# EAGLE design PCBv3.2.1.Arduino (EAGLE 8.5.2)
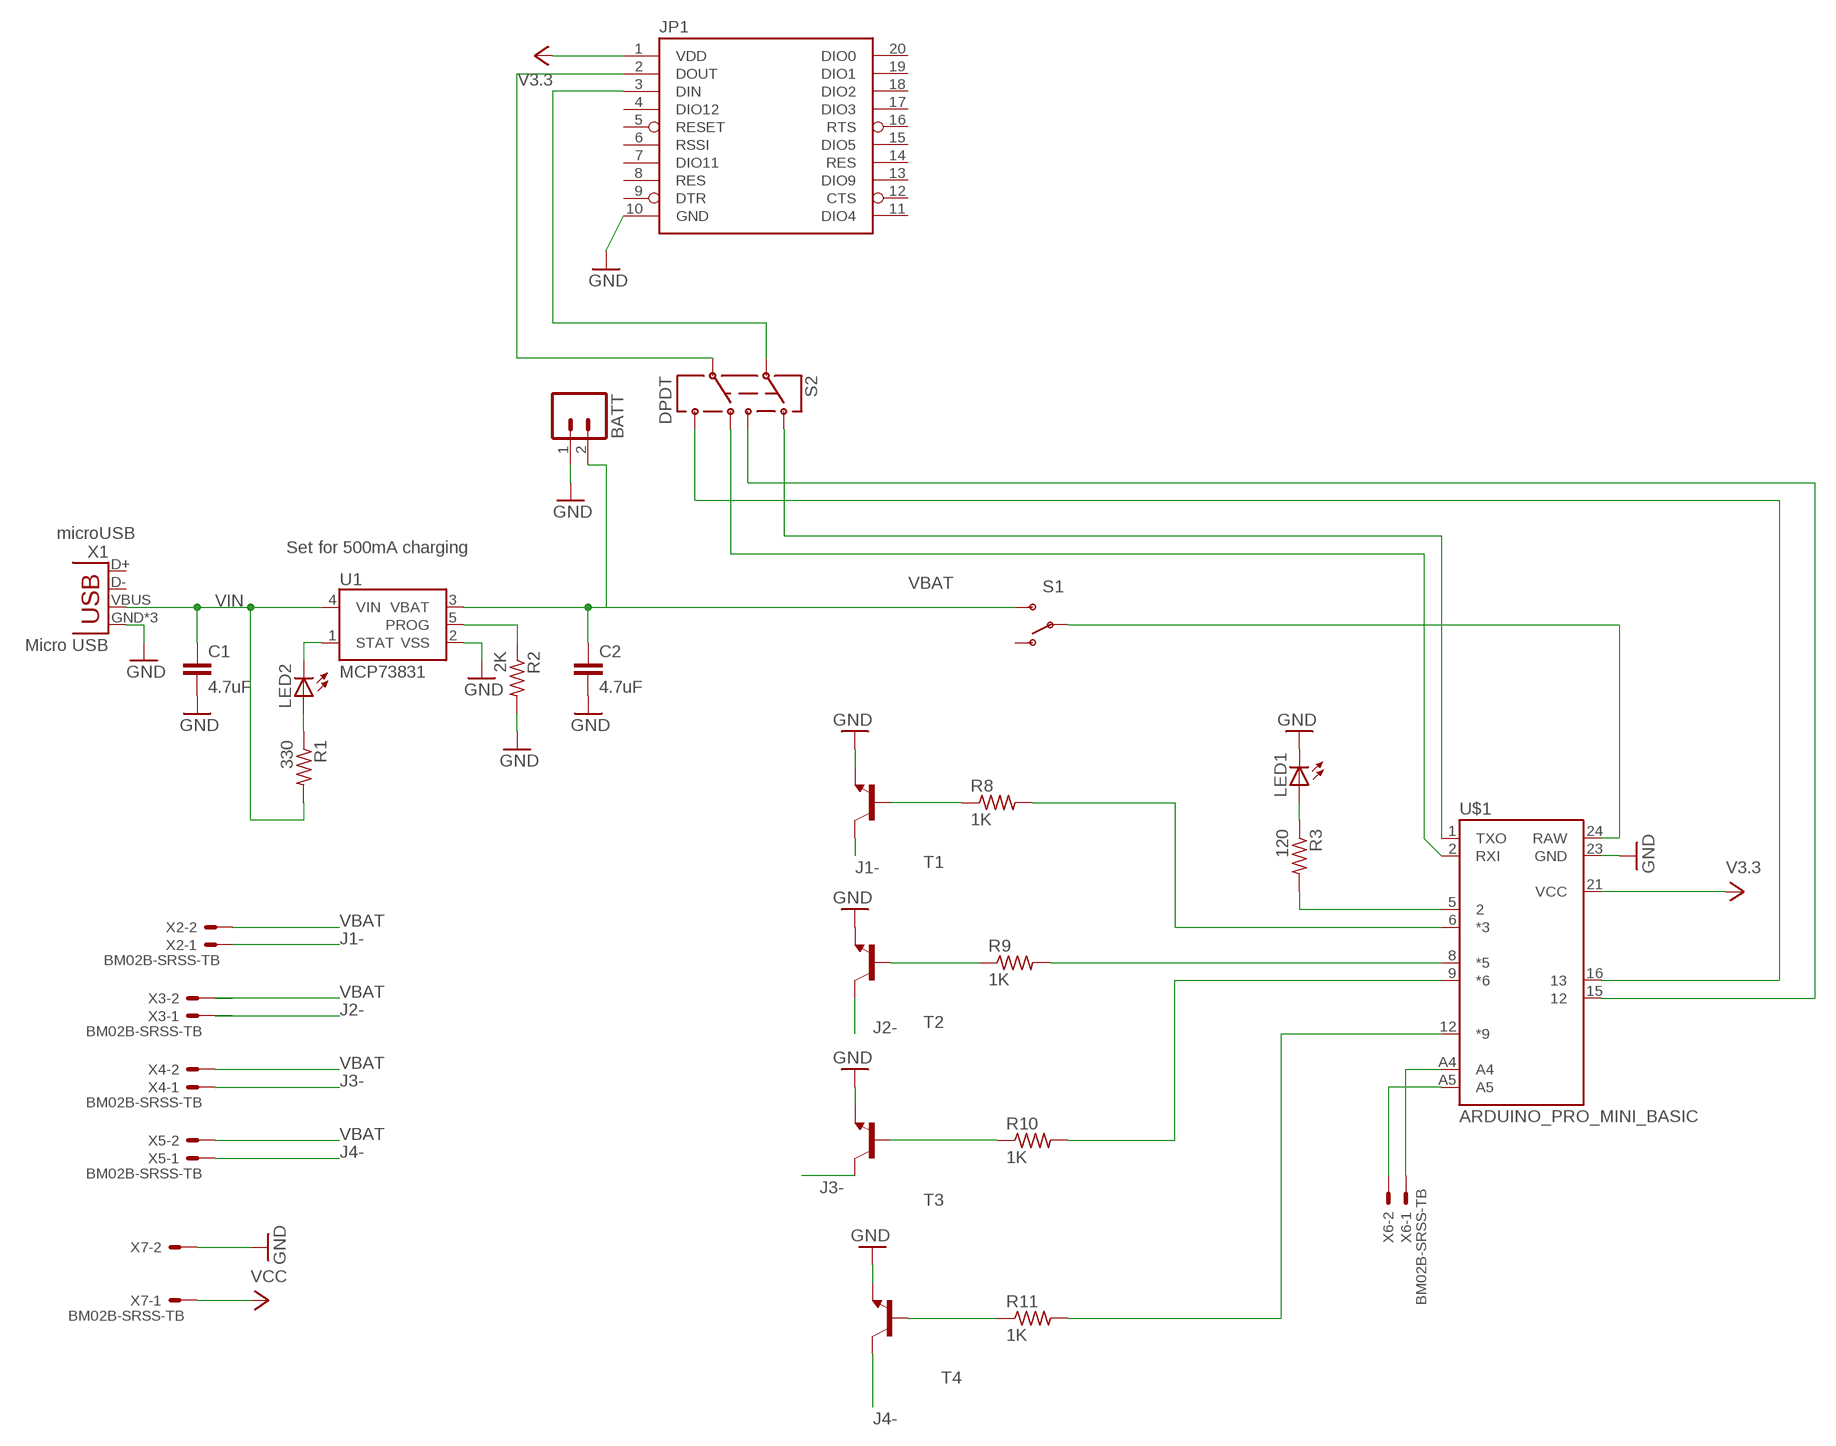
[diagram p0: schematic, sheet 1]

## Parts
BATT  M02JST-PTH-VERT  [JST-2-PTH-VERT]
C1  4.7uF  C-EUC0805  [C0805]
C2  4.7uF  C-EUC0805  [C0805]
JP1  XBEE-1LONGPAD  [XBEE-LONGPAD]
LED1  LED3MM  [LED3MM]
LED2  LEDCHIP-LED0805  [CHIP-LED0805]
R1  330  R-US_R0805  [R0805]
R2  2K  R-US_R0805  [R0805]
R3  120  R-US_R0805  [R0805]
R8  1K  R-US_R0805  [R0805]
R9  1K  R-US_R0805  [R0805]
R10  1K  R-US_R0805  [R0805]
R11  1K  R-US_R0805  [R0805]
S1  SWITCH-SPDTPTH  [SWITCH-SPDT]
S2  DPDT  AYZ0202  [AYZ0202]
T1  BC817-16-NPN-SOT23-BEC  [SOT23-BEC]
T2  BC817-16-NPN-SOT23-BEC  [SOT23-BEC]
T3  BC817-16-NPN-SOT23-BEC  [SOT23-BEC]
T4  BC817-16-NPN-SOT23-BEC  [SOT23-BEC]
U1  MCP73831  [SOT23-5]
U$1  ARDUINO_PRO_MINI_BASIC  [ARDUINO_PRO_MINI_BASIC]
X1  Micro USB  USB-MICROB  [USB-MICROB]
X2  BM02B-SRSS-TB  [BM02B-SRSS-TB]
X3  BM02B-SRSS-TB  [BM02B-SRSS-TB]
X4  BM02B-SRSS-TB  [BM02B-SRSS-TB]
X5  BM02B-SRSS-TB  [BM02B-SRSS-TB]
X6  BM02B-SRSS-TB  [BM02B-SRSS-TB]
X7  BM02B-SRSS-TB  [BM02B-SRSS-TB]

## Nets
GND: BATT.1 C1.2 C2.2 JP1.10(GND) LED1.K(C) R2.2 T1.E T2.E T3.E T4.E U1.2(VSS) U$1.23(GND) X1.GND X1.MT1(GND) X1.MT2(GND) X7.2
J1-: T1.C X2.1
J2-: T2.C X3.1
J3-: T3.C X4.1
J4-: T4.C X5.1
N$1: R3.2 U$1.5
N$2: U$1.A4 X6.1
N$3: U$1.A5 X6.2
N$5: R10.2 U$1.9(*6)
N$6: S2.1 U$1.15
N$7: S1.2(P) U$1.24(RAW)
N$8: LED1.A R3.1
N$9: R9.2 U$1.8(*5)
N$10: R8.1 T1.B
N$11: R8.2 U$1.6(*3)
N$12: LED2.A R1.1
N$13: S2.4 U$1.16
N$14: R9.1 T2.B
N$16: R11.1 T4.B
N$17: S2.6 U$1.2(RXI)
N$18: S2.3 U$1.1(TXO)
N$21: R11.2 U$1.12(*9)
N$22: R10.1 T3.B
N$23: JP1.2(DOUT) S2.5
N$25: JP1.3(DIN) S2.2
PROG: R2.1 U1.5(PROG)
STAT: LED2.C U1.1(STAT)
VBAT: BATT.2 C2.1 S1.3(S) U1.3(VBAT) X2.2 X3.2 X4.2 X5.2
VCC: JP1.1(VDD) U$1.21(VCC) X7.1 ; supply symbol labelled V3.3
VIN: C1.1 R1.2 U1.4(VIN) X1.VBUS
Unconnected: JP1.4(DIO12) JP1.5(RESET) JP1.6(RSSI) JP1.7(DIO11) JP1.8(RES) JP1.9(DTR) JP1.11(DIO4) JP1.12(CTS) JP1.13(DIO9) JP1.14(RES) JP1.15(DIO5) JP1.16(RTS) JP1.17(DIO3) JP1.18(DIO2) JP1.19(DIO1) JP1.20(DIO0) S1.1(O) X1.D+ X1.D-

## Notes on the sheet
- microUSB
- Set for 500mA charging

## Library data of the parts
BATT = SparkFun-Connectors:M02: Standard 2-pin 0.1" header. Use with - straight break away headers ( PRT-00116) - right angle break away headers (PRT-00553) - swiss pins (PRT-00743) - machine pins (PRT-00117) - female headers (PRT-00115) Molex polarized connector foot print use with: PRT-08233 with associated crimp pins and housings. 2.54_SCREWTERM for use with PRT-10571. 3.5mm Screw Terminal footprints for PRT-08084 5mm Screw Terminal footprints for use with PRT-08432; MF: JST (JAPAN SOLDERLESS TERMINALS); MPN: S2B-PH-K-S (LF)(SN); OC_FARNELL: 9491902
C1 C2 = rcl:C-EU: CAPACITOR, European symbol; MF: TDK; MPN: C1005X5R0J475K050BC; OC_FARNELL: 2346876
JP1 = SparkFun-RF:XBEE-1: Xbee module footprints; OC_FARNELL: unknown
LED1 = Personale:LED: LED OSRAM: - CHIPLED LG R971, LG N971, LY N971, LG Q971, LY Q971, LO R971, LY R971 LH N974, LH R974 LS Q976, LO Q976, LY Q976 LO Q996 - Hyper CHIPLED LW Q18S LB Q993, LB Q99A, LB R99A - SideLED LS A670, LO A670, LY A670, LG A670, LP A670 LB A673, LV A673, LT A673, LW A673 LH A674 LY A675 LS A676, LA A676, LO A676, LY A676, LW A676 LS A679, LY A679, LG A679 - Hyper Micro SIDELED® LS Y876, LA Y876, LO Y876, LY Y876 LT Y87S - SmartLED LW L88C, LW L88S LB L89C, LB L89S, LG L890 LS L89K, LO L89K, LY L89K LS L896, LA L896, LO L896, LY L896 - TOPLED LS T670, LO T670, LY T670, LG T670, LP T670 LSG T670, LSP T670, LSY T670, LOP T670, LYG T670 LG T671, LOG T671, LSG T671 LB T673, LV T673, LT T673, LW T673 LH T674 LS T676, LA T676, LO T676, LY T676, LB T676, LH T676, LSB T676, LW T676 LB T67C, LV T67C, LT T67C, LS T67K, LO T67K, LY T67K, LW E67C LS E67B, LA E67B, LO E67B, LY E67B, LB E67C, LV E67C, LT E67C LW T67C LS T679, LY T679, LG T679 LS T770, LO T770, LY T770, LG T770, LP T770 LB T773, LV T773, LT T773, LW T773 LH T774 LS E675, LA E675, LY E675, LS T675 LS T776, LA T776, LO T776, LY T776, LB T776 LHGB T686 LT T68C, LB T68C - Hyper Mini TOPLED® LB M676 - Mini TOPLED Santana® LG M470 LS M47K, LO M47K, LY M47K Source: http://www.osram.convergy.de LUXEON: - LUMILED® LXK2-PW12-R00, LXK2-PW12-S00, LXK2-PW14-U00, LXK2-PW14-V00 LXK2-PM12-R00, LXK2-PM12-S00, LXK2-PM14-U00 LXK2-PE12-Q00, LXK2-PE12-R00, LXK2-PE12-S00, LXK2-PE14-T00, LXK2-PE14-U00 LXK2-PB12-K00, LXK2-PB12-L00, LXK2-PB12-M00, LXK2-PB14-N00, LXK2-PB14-P00, LXK2-PB14-Q00 LXK2-PR12-L00, LXK2-PR12-M00, LXK2-PR14-Q00, LXK2-PR14-R00 LXK2-PD12-Q00, LXK2-PD12-R00, LXK2-PD12-S00 LXK2-PH12-R00, LXK2-PH12-S00 LXK2-PL12-P00, LXK2-PL12-Q00, LXK2-PL12-R00 Source: www.luxeon.com KINGBRIGHT: KA-3528ASYC Source: www.kingbright.com; MF: MULTICOMP; MPN: MCL034GT; OC_FARNELL: 1581123
LED2 = led:LED: LED OSRAM: - CHIPLED LG R971, LG N971, LY N971, LG Q971, LY Q971, LO R971, LY R971 LH N974, LH R974 LS Q976, LO Q976, LY Q976 LO Q996 - Hyper CHIPLED LW Q18S LB Q993, LB Q99A, LB R99A - SideLED LS A670, LO A670, LY A670, LG A670, LP A670 LB A673, LV A673, LT A673, LW A673 LH A674 LY A675 LS A676, LA A676, LO A676, LY A676, LW A676 LS A679, LY A679, LG A679 - Hyper Micro SIDELED® LS Y876, LA Y876, LO Y876, LY Y876 LT Y87S - SmartLED LW L88C, LW L88S LB L89C, LB L89S, LG L890 LS L89K, LO L89K, LY L89K LS L896, LA L896, LO L896, LY L896 - TOPLED LS T670, LO T670, LY T670, LG T670, LP T670 LSG T670, LSP T670, LSY T670, LOP T670, LYG T670 LG T671, LOG T671, LSG T671 LB T673, LV T673, LT T673, LW T673 LH T674 LS T676, LA T676, LO T676, LY T676, LB T676, LH T676, LSB T676, LW T676 LB T67C, LV T67C, LT T67C, LS T67K, LO T67K, LY T67K, LW E67C LS E67B, LA E67B, LO E67B, LY E67B, LB E67C, LV E67C, LT E67C LW T67C LS T679, LY T679, LG T679 LS T770, LO T770, LY T770, LG T770, LP T770 LB T773, LV T773, LT T773, LW T773 LH T774 LS E675, LA E675, LY E675, LS T675 LS T776, LA T776, LO T776, LY T776, LB T776 LHGB T686 LT T68C, LB T68C - Hyper Mini TOPLED® LB M676 - Mini TOPLED Santana® LG M470 LS M47K, LO M47K, LY M47K Source: http://www.osram.convergy.de LUXEON: - LUMILED® LXK2-PW12-R00, LXK2-PW12-S00, LXK2-PW14-U00, LXK2-PW14-V00 LXK2-PM12-R00, LXK2-PM12-S00, LXK2-PM14-U00 LXK2-PE12-Q00, LXK2-PE12-R00, LXK2-PE12-S00, LXK2-PE14-T00, LXK2-PE14-U00 LXK2-PB12-K00, LXK2-PB12-L00, LXK2-PB12-M00, LXK2-PB14-N00, LXK2-PB14-P00, LXK2-PB14-Q00 LXK2-PR12-L00, LXK2-PR12-M00, LXK2-PR14-Q00, LXK2-PR14-R00 LXK2-PD12-Q00, LXK2-PD12-R00, LXK2-PD12-S00 LXK2-PH12-R00, LXK2-PH12-S00 LXK2-PL12-P00, LXK2-PL12-Q00, LXK2-PL12-R00 Source: www.luxeon.com KINGBRIGHT: KA-3528ASYC Source: www.kingbright.com; MF: KINGBRIGHT; MPN: KPT-2012QBC-D; OC_FARNELL: 2217980
R1 R8-R11 = resistor:R-US_: RESISTOR, American symbol; MF: MULTICOMP; MPN: MC01W08051330R; OC_FARNELL: 9333037RL
R2 = resistor:R-US_: RESISTOR, American symbol; MF: MULTICOMP; MPN: MC01W080512K; OC_FARNELL: 9332766
R3 = resistor:R-US_: RESISTOR, American symbol; MF: AVAGO TECHNOLOGIES; MPN: ASMT-YWB1-NGJB2; OC_FARNELL: 2407095
S1 = SparkFun-Electromechanical:SWITCH-SPDT: SPDT Switch Simple slide switch, Spark Fun Electronics SKU : COM-00102 DPDT SMT slide switch, AYZ0202, SWCH-08179; MF: EAO; MPN: 09-10201-02; OC_FARNELL: 1608081; PROD_ID: SWCH-08261
S2 = SparkFun:AYZ0202: SPDT Slide Switch Simple SMD single-pull double-throw slide switch. Good for less than 350mA power switch, switching UARTs between devices, etc. Spark Fun Electronics SKU : COM-00597; MF: C & K COMPONENTS; MPN: AYZ0202AGRLC; OC_FARNELL: 2319973
T1-T4 = transistor:*-NPN-: NPN Transistror BF959 corrected 2008.03.06; MF: ON SEMICONDUCTOR; MPN: BC817-40LT3G; OC_FARNELL: 2533302
U1 = SparkFun:MCP73831: Microchip's MCP73831 Miniature single cell, fully integrated Li-Ion, Li-polymer charge management controller http://ww1.microchip.com/downloads/en/DeviceDoc/21984a.pdf; MF: MICROCHIP; MPN: MCP73831T-2ACI/OT; OC_FARNELL: 1332158
U$1 = sirslab:ARDUINO_PRO_MINI_BASIC
X1 = SparkFun-Connectors:USB: USB Connectors USB-B-PTH is fully proven SKU : PRT-00139/CONN-08278 USB-miniB is fully proven SKU : PRT-00587 USB-A-PCB is untested. USB-A-H is throughly reviewed, but untested. Spark Fun Electronics SKU : PRT-00437 USB-B-SMT is throughly reviewed, but untested. Needs silkscreen touching up. USB-A-S has not been used/tested USB-MB-H has not been used/tested USB-MICROB has been used. CONN-09505; MF: HIROSE(HRS); MPN: ZX62-B-5PA(33); OC_FARNELL: 2554978; PROD_ID: CONN-09505
X2-X7 = con-jst2:?M02B-SRSS-TB: Disconnectable Crimp style connector, 1.0mm pitch 2 contacts

## Net classes
0 default: width 0.203 mm
1 vcc: width 0.254 mm

## Board
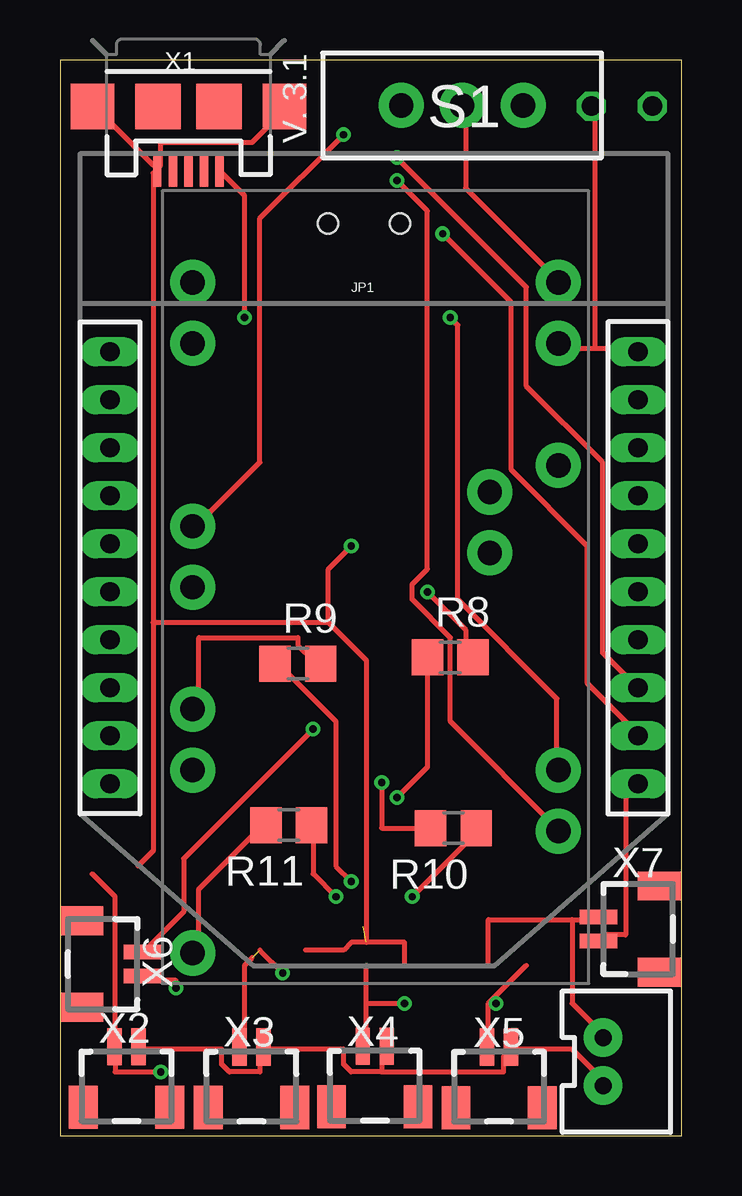
[diagram p1: board, top side]
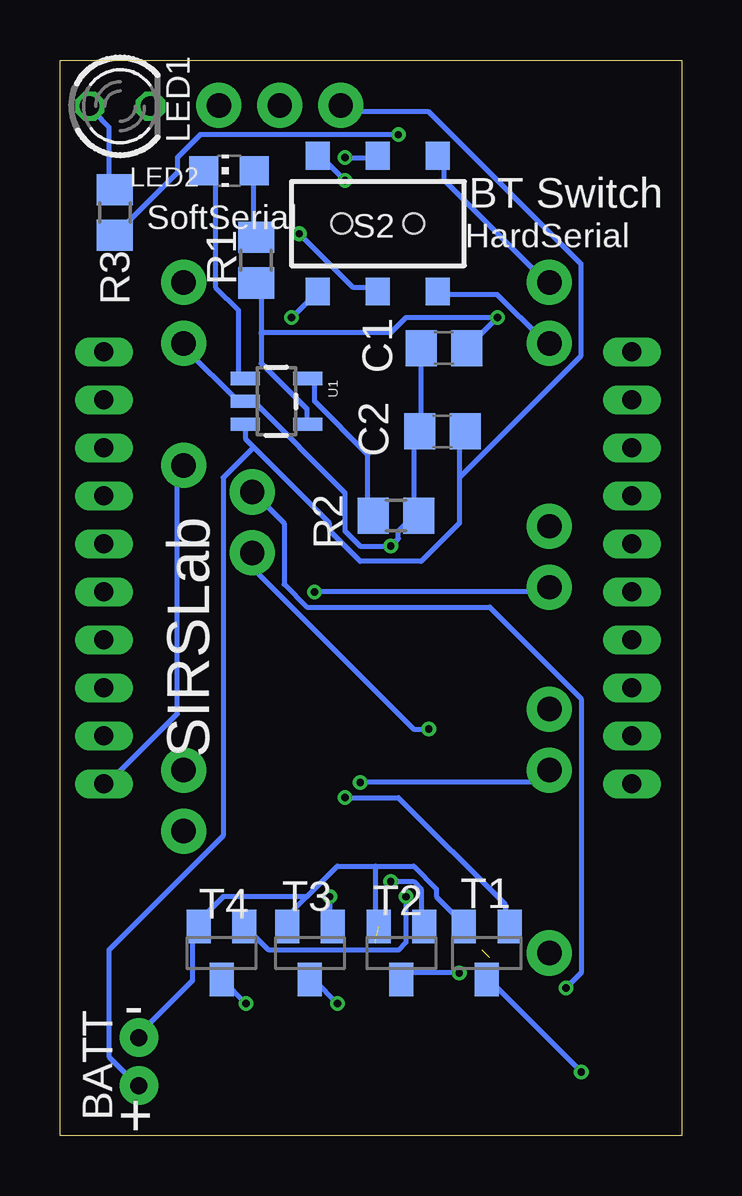
[diagram p2: board, bottom side, seen from below]

Size 25.91 x 44.83 mm. Coordinates in mm from the lower left corner, seen from the top.
Outline: 0,0 25.91,0 25.91,44.83 0,44.83 0,0
Copper layers (1*16): Top 0.035mm / dielectric 1.6mm / Bottom 0.035mm
Design rules "Elecrow_2-layer_PCB_eagle_rule": minimum track width 6mil, minimum drill 12mil, track to track 6mil, track to pad 6mil, pad to pad 6mil, via to via 8mil, smd to smd 0mil, copper to edge 20mil, drill to drill 10mil, minimum pad ring 6mil, minimum via ring 6mil, stop-mask expansion 0mil, vias tented up to drill 100mil, thermal gap 10mil

### Footprints (pad centres in the part's own frame; a part is rotated, then mirrored left to right if it is on the bottom)
JST-2-PTH-VERT = drill 0.7 pad 1.6: 1 -1,-0.55; 2 1,-0.55
C0805 = smd 1.3 x 1.5: 1 -0.95,0; 2 0.95,0
XBEE-LONGPAD = drill 0.8 pad 1.206 long: 1 -11,20; 2 -11,18; 3 -11,16; 4 -11,14; 5 -11,12; 6 -11,10; 7 -11,8; 8 -11,6; 9 -11,4; 10 -11,2; 11 11,2; 12 11,4; 13 11,6; 14 11,8; 15 11,10; 16 11,12; 17 11,14; 18 11,16; 19 11,18; 20 11,20
LED3MM = drill 0.813 octagon: A -1.27,0; K 1.27,0
CHIP-LED0805 = smd 1.2 x 1.2: A 0,-1.05; C 0,1.05
R0805 = smd 1.3 x 1.5: 1 -0.95,0; 2 0.95,0
SWITCH-SPDT = drill 1.016 pad 1.88: 1 0,2.54; 2 0,0; 3 0,-2.54
AYZ0202 = smd 1 x 1.15: 1 -2.5,2.825; 2 0,2.825; 3 2.5,2.825; 4 -2.5,-2.825; 5 0,-2.825; 6 2.5,-2.825 | hole 0.85: 1.5,0; -1.5,0
SOT23-BEC = smd 1 x 1.4: B -0.95,-1.1; C 0,1.1; E 0.95,-1.1
SOT23-5 = smd 0.55 x 1.2: 1 -0.95,-1.3; 2 0,-1.3; 3 0.95,-1.3; 4 0.95,1.3; 5 -0.95,1.3
ARDUINO_PRO_MINI_BASIC = drill 1.016 pad 1.88: 1 -7.62,12.7; 2 -7.62,10.16; 5 -7.62,2.54; 6 -7.62,0; 8 -7.62,-5.08; 9 -7.62,-7.62; 12 -7.62,-15.24; 15 7.62,-10.16; 16 7.62,-7.62; 21 7.62,5.08; 23 7.62,10.16; 24 7.62,12.7; A4 4.763,1.429; A5 4.763,3.969
USB-MICROB = smd 0.35 x 1.4: D+ 0,2.65; D- -0.65,2.65; GND 1.3,2.65; ID 0.65,2.65; VBUS -1.3,2.65 | smd 1.8 x 1.9: MT1 -4,0; MT2 4,0 | smd 1.9 x 1.9: P$1 -1.27,0; P$2 1.27,0
BM02B-SRSS-TB = smd 0.6 x 1.55: 1 0.5,-1.625; 2 -0.5,-1.625 | smd 1.2 x 1.8: FIT@1 1.8,0.9; FIT@2 -1.8,0.9

### Placement (x,y rotation side)
BATT  23.17,3.1 270 top
C1  9.91,32.83 180 bottom
C2  9.97,29.36 180 bottom
JP1  13.08,34.67 180 top
LED1  23.4,42.9 0 bottom
LED2  18.87,40.22 90 bottom
R1  17.74,36.49 270 bottom
R2  11.91,25.85 0 bottom
R3  23.62,38.48 270 bottom
R8  16.26,19.94 0 top
R9  9.91,19.69 0 top
R10  16.38,12.83 180 top
R11  9.53,12.95 180 top
S1  16.75,42.94 270 top
S2  12.66,38.02 0 bottom
T1  8.13,7.62 180 bottom
T2  11.68,7.62 180 bottom
T3  15.49,7.62 180 bottom
T4  19.18,7.62 180 bottom
U1  16.89,30.61 270 bottom
U$1  13.14,22.86 0 top
X1  5.34,42.9 180 top
X2  2.77,2.09 180 top
X3  7.97,2.08 180 top
X4  13.11,2.11 180 top
X5  18.29,2.08 180 top
X6  1.79,7.16 90 top
X7  24.06,8.62 270 top

### Tracks (layer width: path | path; a pad name or v marks a point on that pad's centre or on a via)
GND  (via drill 0.3)  (1 unrouted)
  Top 0.203: 22.29,32.83 21.02,32.83 U$1.23 | 22.29,32.83 23.88,32.83 JP1.10 | 22.29,32.83 22.29,42.67 LED1.K | 10.22,7.75 11.81,7.75 12.13,8.06 12.76,8.06 | 12.76,8.06 14.35,8.06 14.35,7.11 | 21.34,9.02 17.84,9.02 17.84,7.11 | 21.34,9.02 22.29,9.02 X7.2 | 21.34,9.02 21.34,5.52 22.61,4.25 BATT.1 | 3.24,11.24 3.87,11.88 3.87,21.4 | 3.87,21.4 3.87,40.13 X1.GND | X1.MT2 1.65,42.67 3.87,40.45 X1.GND | X1.MT1 9.27,42.67 8,41.4 4.19,41.4 4.19,40.45 X1.GND | 12.76,8.06 12.76,19.81 11.18,21.4 | 3.87,21.4 11.18,21.4 | v12.13,24.57 11.18,23.62 11.18,21.4
  Bottom 0.203: C1.2 10.86,32.51 10.86,29.66 C2.2 11.18,29.34 11.18,26.16 R2.2 11.18,25.84 11.81,25.21 11.81,24.89 v12.13,24.57 13.4,24.57 14.03,25.21 14.03,26.8 17.84,30.61 U1.2 18.48,30.61 20.7,32.83 U$1.23 | 12.76,11.24 14.35,11.24 15.62,9.97 | 12.76,11.24 11.18,11.24 10.22,10.29 10.22,9.97 9.27,9.02 T1.E | 15.62,9.97 16.57,9.02 T3.E | 12.76,11.24 12.76,9.02 T2.E | 15.62,9.97 19.11,9.97 20.07,9.02 T4.E 20.38,8.7 20.38,6.48 22.61,4.25 BATT.1
J1-  (via drill 0.3)
  Top 0.203: 1.33,10.92 2.29,9.97 2.29,3.94 X2.1 2.29,3.62 2.29,2.67 v4.19,2.67
  Bottom 0.203: v4.19,2.67 8,6.48 T1.C
J2-  (via drill 0.3)  (1 unrouted)
  Top 0.203: 8,7.43 7.68,7.11 7.68,3.94 X3.1 | 8.32,7.75 v9.27,6.79
  Bottom 0.203: v9.27,6.79 11.49,6.79 T2.C
J3-  (via drill 0.3)
  Top 0.203: 12.76,5.52 12.76,3.94 X4.1 | 12.76,5.52 12.76,7.11 | 12.76,5.52 v14.35,5.52
  Bottom 0.203: v14.35,5.52 15.3,6.48 T3.C
J4-  (via drill 0.3)
  Top 0.203: 17.84,5.52 19.43,7.11 | 17.84,5.52 17.84,3.94 X5.1 | 17.84,5.52 v18.16,5.52
  Bottom 0.203: v18.16,5.52 19.11,6.48 T4.C
N$1  (via drill 0.3)
  Top 0.203: v11.81,41.72 8.32,38.23 8.32,28.07 5.78,25.53 U$1.5
  Bottom 0.203: v11.81,41.72 20.07,41.72 21.02,40.77 21.02,40.13 23.56,37.59 R3.2
N$2  (via drill 0.3)
  Top 0.203: v10.54,16.95 5.14,11.56 5.14,9.33 3.56,7.75 X6.1
  Bottom 0.203: v10.54,16.95 11.18,16.95 17.84,23.62 17.84,24.26 U$1.A4
N$3  (via drill 0.3)
  Top 0.203: v4.83,6.16 4.83,6.48 3.56,6.48 X6.2
  Bottom 0.203: v4.83,6.16 4.19,6.79 4.19,18.23 8,22.04 15.62,22.04 16.57,22.99 16.57,25.53 17.84,26.8 U$1.A5
N$5  (via drill 0.3)
  Top 0.203: R10.2 13.4,12.83 v13.4,14.73
  Bottom 0.203: v13.4,14.73 6.1,14.73 5.78,15.05 U$1.9
N$6  (via drill 0.3)
  Top 0.203: v14.03,39.81 15.3,38.54 15.3,23.62 14.67,22.99 14.67,22.35 16.26,20.77 16.26,17.27 20.7,12.83 U$1.15
  Bottom 0.203: v14.03,39.81 14.99,40.77 S2.1
N$7
  Top 0.203: U$1.24 20.7,35.69 16.89,39.5 16.89,42.67 S1.2
N$8
  Bottom 0.203: R3.1 23.88,39.5 23.88,42.04 24.51,42.67 LED1.A
N$9
  Top 0.203: R9.2 10.54,19.81 9.91,20.45 9.91,20.77 5.78,20.77 5.78,17.91 U$1.8
N$10  (via drill 0.3)
  Top 0.203: v14.03,14.1 15.3,15.37 15.3,19.81 R8.1
  Bottom 0.203: v14.03,14.1 11.81,14.1 7.37,9.65 7.37,9.02 T1.B
N$11  (via drill 0.3)
  Top 0.203: v15.3,22.67 16.89,21.08 16.89,20.13 R8.2
  Bottom 0.203: v15.3,22.67 5.78,22.67 U$1.6
N$12
  Bottom 0.203: LED2.A 17.84,40.13 17.84,37.59 R1.1
N$13  (via drill 0.3)
  Top 0.203: v16.26,34.1 16.57,33.78 16.57,22.35 20.7,18.23 20.7,15.37 U$1.16
  Bottom 0.203: v16.26,34.1 15.3,35.05 S2.4
N$14  (via drill 0.3)
  Top 0.203: v12.13,10.61 11.49,11.24 11.49,17.27 9.27,19.5 R9.1
  Bottom 0.203: v12.13,10.61 11.18,10.61 10.86,10.29 10.86,9.02 T2.B
N$16  (via drill 0.3)
  Top 0.203: v11.49,9.97 10.54,10.92 10.54,12.83 R11.1
  Bottom 0.203: v11.49,9.97 11.49,8.06 11.81,7.75 17.21,7.75 18.16,8.7 T4.B
N$17
  Bottom 0.203: S2.6 9.91,35.05 7.68,35.05 5.78,33.15 U$1.2
N$18
  Bottom 0.203: S2.3 9.91,40.77 9.91,39.81 5.78,35.69 U$1.1
N$21
  Top 0.203: R11.2 8.32,12.83 5.78,10.29 5.78,7.75 U$1.12
N$22  (via drill 0.3)
  Top 0.203: v14.67,9.97 17.21,12.51 17.21,12.83 R10.1
  Bottom 0.203: v14.67,9.97 14.67,9.02 T3.B
N$23  (via drill 0.3)
  Top 0.203: v15.94,37.59 18.8,34.73 18.8,27.75 21.97,24.57 21.97,18.86 23.88,16.95 JP1.2
  Bottom 0.203: v15.94,37.59 13.72,35.37 12.76,35.37 S2.5
N$25  (via drill 0.3)
  Top 0.203: v14.03,40.77 19.43,35.37 19.43,31.24 22.61,28.07 22.61,20.13 23.88,18.86 JP1.3
  Bottom 0.203: v14.03,40.77 12.76,40.77 S2.2
PROG
  Bottom 0.203: U1.5 15.3,31.56 15.3,30.61 13.08,28.38 13.08,26.16 R2.1
STAT
  Bottom 0.203: U1.1 18.48,31.56 18.48,34.42 19.43,35.37 19.43,39.81 19.75,40.13 LED2.C
VBAT
  Top 0.203: 18.8,3.62 21.34,3.62 22.61,2.35 BATT.2 | 13.4,2.67 12.13,2.67 11.81,2.98 11.81,3.62 8.64,3.62 X3.2 8.32,3.62 8.32,2.67 7.05,2.67 6.73,2.98 6.73,3.62 3.56,3.62 X2.2 | 13.4,2.67 13.4,3.62 X4.2 | 18.8,3.62 18.48,3.3 18.48,2.67 13.4,2.67 | 18.8,3.62 X5.2
  Bottom 0.203: 17.84,28.7 14.67,25.53 14.67,25.21 13.4,23.94 10.86,23.94 9.27,25.53 9.27,27.43 | 17.84,28.7 18.16,29.02 18.16,29.66 U1.3 | 9.27,27.43 9.27,29.34 C2.1 | 9.27,27.43 4.19,32.51 4.19,36.32 10.54,42.67 14.03,42.67 S1.3 | 17.84,28.7 19.11,27.43 19.11,12.51 23.88,7.75 23.88,3.3 22.92,2.35 BATT.2
VCC
  Top 0.203: X7.1 22.61,8.38 23.56,8.38 23.56,14.1 23.88,14.41 JP1.1
  Bottom 0.203: U$1.21 21.02,27.75 21.02,17.59 23.88,14.73 JP1.1
VIN  (via drill 0.3)
  Top 0.203: v7.68,34.1 7.68,39.18 6.73,40.13 X1.VBUS
  Bottom 0.203: 17.53,33.46 17.53,35.37 R1.2 | 17.53,33.46 17.53,32.2 15.62,30.29 15.62,29.66 U1.4 | C1.1 v7.68,34.1 11.49,34.1 12.13,33.46 17.53,33.46

### Text on the board
tNames: V. 3.1
bNames: BT Switch | HardSerial | SoftSerial | SIRSLab | - | +